# Altium schematic sheet etapa1_suma.SchDoc
size A4
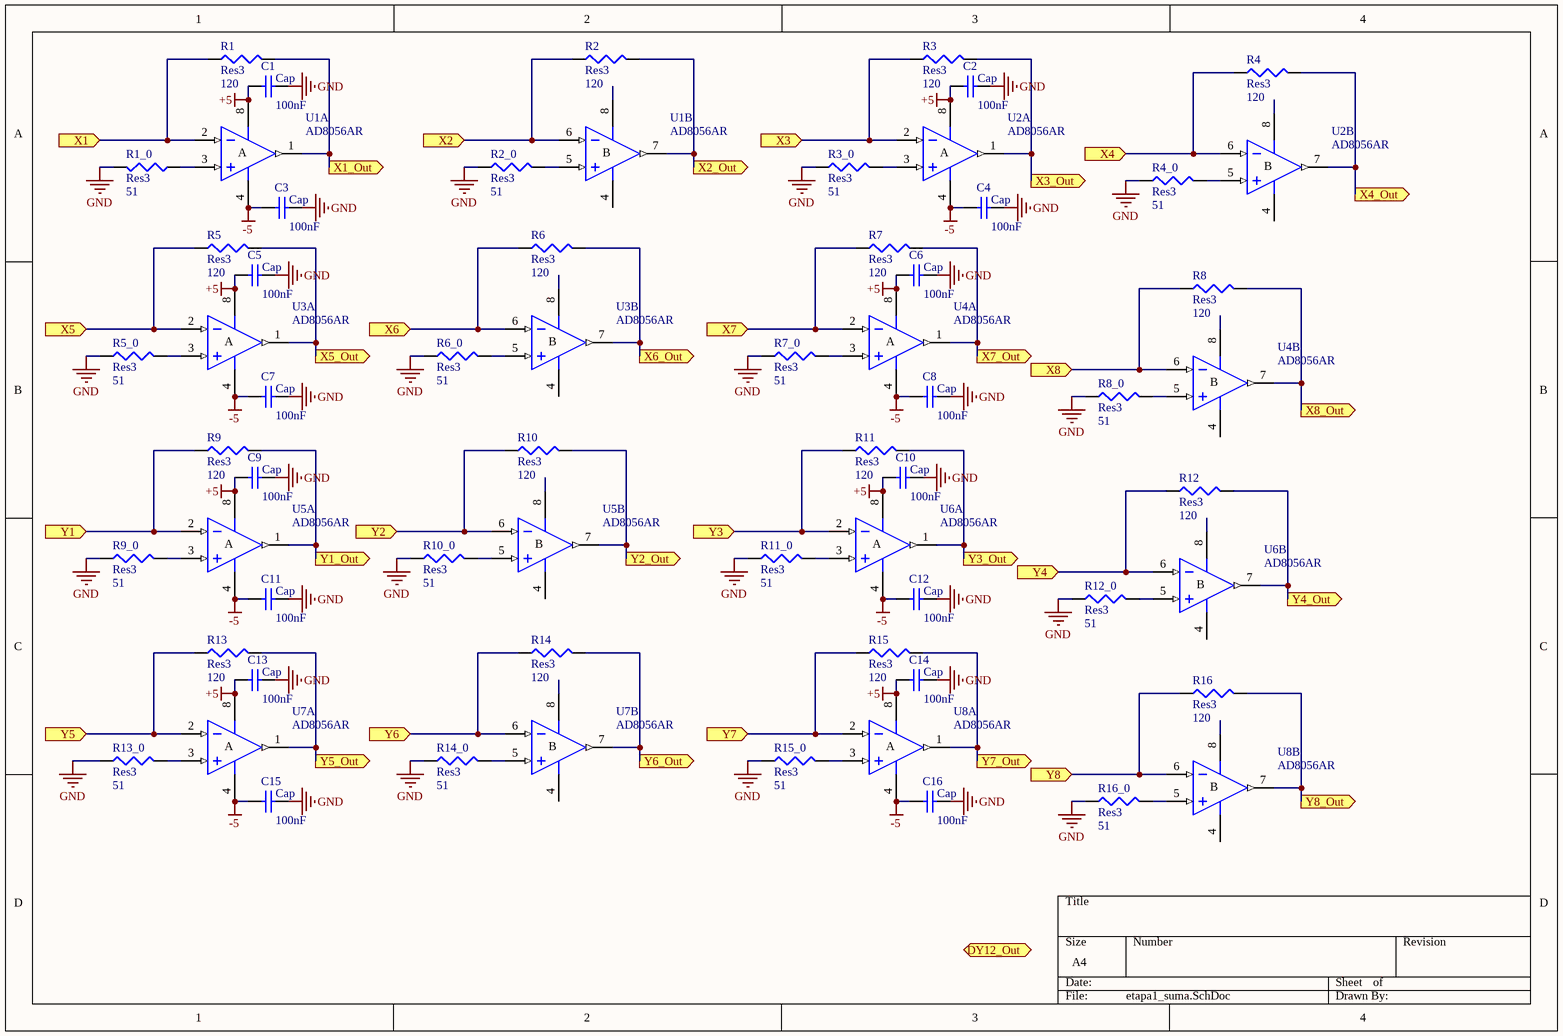
[diagram p0: etapa1_suma.SchDoc]

## Parts
C1  Cap  value 100nF  [1608[0603]]
C2  Cap  value 100nF  [1608[0603]]
C3  Cap  value 100nF  [1608[0603]]
C4  Cap  value 100nF  [1608[0603]]
C5  Cap  value 100nF  [1608[0603]]
C6  Cap  value 100nF  [1608[0603]]
C7  Cap  value 100nF  [1608[0603]]
C8  Cap  value 100nF  [1608[0603]]
C9  Cap  value 100nF  [1608[0603]]
C10  Cap  value 100nF  [1608[0603]]
C11  Cap  value 100nF  [1608[0603]]
C12  Cap  value 100nF  [1608[0603]]
C13  Cap  value 100nF  [1608[0603]]
C14  Cap  value 100nF  [1608[0603]]
C15  Cap  value 100nF  [1608[0603]]
C16  Cap  value 100nF  [1608[0603]]
R1  Res3  value 120  [0402]
R1_0  Res3  value 51  [0402]
R2  Res3  value 120  [0402]
R2_0  Res3  value 51  [0402]
R3  Res3  value 120  [0402]
R3_0  Res3  value 51  [0402]
R4  Res3  value 120  [0402]
R4_0  Res3  value 51  [0402]
R5  Res3  value 120  [0402]
R5_0  Res3  value 51  [0402]
R6  Res3  value 120  [0402]
R6_0  Res3  value 51  [0402]
R7  Res3  value 120  [0402]
R7_0  Res3  value 51  [0402]
R8  Res3  value 120  [0402]
R8_0  Res3  value 51  [0402]
R9  Res3  value 120  [0402]
R9_0  Res3  value 51  [0402]
R10  Res3  value 120  [0402]
R10_0  Res3  value 51  [0402]
R11  Res3  value 120  [0402]
R11_0  Res3  value 51  [0402]
R12  Res3  value 120  [0402]
R12_0  Res3  value 51  [0402]
R13  Res3  value 120  [0402]
R13_0  Res3  value 51  [0402]
R14  Res3  value 120  [0402]
R14_0  Res3  value 51  [0402]
R15  Res3  value 120  [0402]
R15_0  Res3  value 51  [0402]
R16  Res3  value 120  [0402]
R16_0  Res3  value 51  [0402]
U1  AD8056AR  [RM-8]  (parts A,B of 2)
U2  AD8056AR  [RM-8]  (parts A,B of 2)
U3  AD8056AR  [RM-8]  (parts A,B of 2)
U4  AD8056AR  [RM-8]  (parts A,B of 2)
U5  AD8056AR  [RM-8]  (parts A,B of 2)
U6  AD8056AR  [RM-8]  (parts A,B of 2)
U7  AD8056AR  [RM-8]  (parts A,B of 2)
U8  AD8056AR  [RM-8]  (parts A,B of 2)

## Ports
DY12_Out (out), X1 (in), X1_Out (out), X2 (in), X2_Out (out), X3 (in), X3_Out (out), X4 (in), X4_Out (out), X5 (in), X5_Out (out), X6 (in), X6_Out (out), X7 (in), X7_Out (out), X8 (in), X8_Out (out), Y1 (in), Y1_Out (out), Y2 (in), Y2_Out (out), Y3 (in), Y3_Out (out), Y4 (in), Y4_Out (out), Y5 (in), Y5_Out (out), Y6 (in), Y6_Out (out), Y7 (in), Y7_Out (out), Y8 (in), Y8_Out (out)

## Nets
+5: C1.2 C2.2 C5.2 C6.2 C9.2 C10.2 C13.2 C14.2 U1.8(V+) U2.8(V+) U3.8(V+) U4.8(V+) U5.8(V+) U6.8(V+) U7.8(V+) U8.8(V+)
-5: C3.2 C4.2 C7.2 C8.2 C11.2 C12.2 C15.2 C16.2 U1.4(V-) U2.4(V-) U3.4(V-) U4.4(V-) U5.4(V-) U6.4(V-) U7.4(V-) U8.4(V-)
GND: C1.1 C2.1 C3.1 C4.1 C5.1 C6.1 C7.1 C8.1 C9.1 C10.1 C11.1 C12.1 C13.1 C14.1 C15.1 C16.1 R1_0.2 R2_0.1 R3_0.1 R4_0.1 R5_0.1 R6_0.1 R7_0.1 R8_0.1 R9_0.1 R10_0.1 R11_0.1 R12_0.1 R13_0.1 R14_0.1 R15_0.1 R16_0.1
X1: R1.1 U1.2(IN-) ; port X1
X1_Out: R1.2 U1.1(OUT) ; port X1_Out
X2: R2.1 U1.6(IN-) ; port X2
X2_Out: R2.2 U1.7(OUT) ; port X2_Out
X3: R3.1 U2.2(IN-) ; port X3
X3_Out: R3.2 U2.1(OUT) ; port X3_Out
X4: R4.1 U2.6(IN-) ; port X4
X4_Out: R4.2 U2.7(OUT) ; port X4_Out
X5: R5.1 U3.2(IN-) ; port X5
X5_Out: R5.2 U3.1(OUT) ; port X5_Out
X6: R6.1 U3.6(IN-) ; port X6
X6_Out: R6.2 U3.7(OUT) ; port X6_Out
X7: R7.1 U4.2(IN-) ; port X7
X7_Out: R7.2 U4.1(OUT) ; port X7_Out
X8: R8.1 U4.6(IN-) ; port X8
X8_Out: R8.2 U4.7(OUT) ; port X8_Out
Y1: R9.1 U5.2(IN-) ; port Y1
Y1_Out: R9.2 U5.1(OUT) ; port Y1_Out
Y2: R10.1 U5.6(IN-) ; port Y2
Y2_Out: R10.2 U5.7(OUT) ; port Y2_Out
Y3: R11.1 U6.2(IN-) ; port Y3
Y3_Out: R11.2 U6.1(OUT) ; port Y3_Out
Y4: R12.1 U6.6(IN-) ; port Y4
Y4_Out: R12.2 U6.7(OUT) ; port Y4_Out
Y5: R13.1 U7.2(IN-) ; port Y5
Y5_Out: R13.2 U7.1(OUT) ; port Y5_Out
Y6: R14.1 U7.6(IN-) ; port Y6
Y6_Out: R14.2 U7.7(OUT) ; port Y6_Out
Y7: R15.1 U8.2(IN-) ; port Y7
Y7_Out: R15.2 U8.1(OUT) ; port Y7_Out
Y8: R16.1 U8.6(IN-) ; port Y8
Y8_Out: R16.2 U8.7(OUT) ; port Y8_Out
NetR1_0_1: R1_0.1 U1.3(IN+)
NetR2_0_2: R2_0.2 U1.5(IN+)
NetR3_0_2: R3_0.2 U2.3(IN+)
NetR4_0_2: R4_0.2 U2.5(IN+)
NetR5_0_2: R5_0.2 U3.3(IN+)
NetR6_0_2: R6_0.2 U3.5(IN+)
NetR7_0_2: R7_0.2 U4.3(IN+)
NetR8_0_2: R8_0.2 U4.5(IN+)
NetR9_0_2: R9_0.2 U5.3(IN+)
NetR10_0_2: R10_0.2 U5.5(IN+)
NetR11_0_2: R11_0.2 U6.3(IN+)
NetR12_0_2: R12_0.2 U6.5(IN+)
NetR13_0_2: R13_0.2 U7.3(IN+)
NetR14_0_2: R14_0.2 U7.5(IN+)
NetR15_0_2: R15_0.2 U8.3(IN+)
NetR16_0_2: R16_0.2 U8.5(IN+)

## Notes on the sheet
- (in symbol AD8056AR, part A) A
- (in symbol AD8056AR, part B) B

## Library data of the parts
C1-C16 = Cap: Capacitor; Published: 8-Jun-2000; LatestRevisionDate: 17-Jul-2002; LatestRevisionNote: Re-released for DXP Platform.; PackageReference: RAD-0.3; Publisher: Altium Limited; PackageDescription: Radial Cap, Thru-Hole; 2 Leads; 0.3 in Pin Spacing
R1 R1_0 R2 R2_0 R3 R3_0 R4 R4_0 R5 R5_0 R6 R6_0 R7 R7_0 R8 R8_0 R9 R9_0 R10 R10_0 R11 R11_0 R12 R12_0 R13 R13_0 R14 R14_0 R15 R15_0 R16 R16_0 = Res3: Resistor; Published: 8-Jun-2000; LatestRevisionDate: 29-May-2009; LatestRevisionNote: IPC-7351 Footprint Added.; PackageReference: J1-0603; Publisher: Altium Limited; PackageDescription: Chip Resistor
U1-U8 = AD8056AR: Low Cost, 300MHz Voltage Feedback Amplifier; Published: 8-Jun-2000; LatestRevisionDate: 13-Apr-2006; LatestRevisionNote: IPC-7351 Footprint Added.; DatasheetVersion: REV. 0 1997; PackageVersion: revA; PackageReference: SO-8; Publisher: Altium Limited; PackageDescription: 8-Pin Small Outline Integrated Circuit 1.27 mm Pitch; Code_JEDEC: MS-012-AA; Code_IPC: SOIC127P600-8; ComponentLink1Description: Manufacturer Link; ComponentLink1URL: http://www.analog.com/en/prod/0,,759_786_AD8055%2C00.html; ComponentLink2Description: Datasheet; ComponentLink2URL: http://www.analog.com/UploadedFiles/Data_Sheets/40402558757264AD8055_6_i.pdf